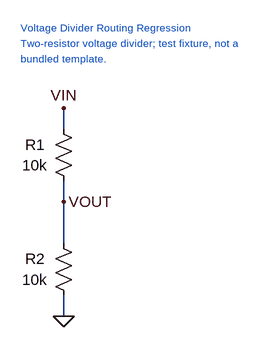
[diagram p0: schematic voltage_divider.asc]
voltage_divider.asc, the LTspice schematic file:
Version 4
SHEET 1 512 544
SYMBOL res 144 176 R0
WINDOW 0 -28 40 Center 2
WINDOW 3 -28 72 Center 2
SYMATTR InstName R1
SYMATTR Value 10k
SYMBOL res 144 352 R0
WINDOW 0 -28 40 Center 2
WINDOW 3 -28 72 Center 2
SYMATTR InstName R2
SYMATTR Value 10k
WIRE 160 160 160 192
WIRE 160 272 160 304
WIRE 160 304 160 368
WIRE 160 448 160 480
FLAG 160 480 0
FLAG 160 160 VIN
FLAG 160 304 VOUT
TEXT 94 36 Left 1 ;Voltage Divider Routing Regression
TEXT 94 60 Left 1 ;Two-resistor voltage divider; test fixture, not a
TEXT 94 84 Left 1 ;bundled template.

The netlist it stands for:
* voltage_divider.asc
R1 VIN VOUT 10k
R2 VOUT 0 10k
* Voltage Divider Routing Regression
* Two-resistor voltage divider; test fixture, not a
* bundled template.
.backanno
.end